# Altium schematic sheet sch.SchDoc
size A4
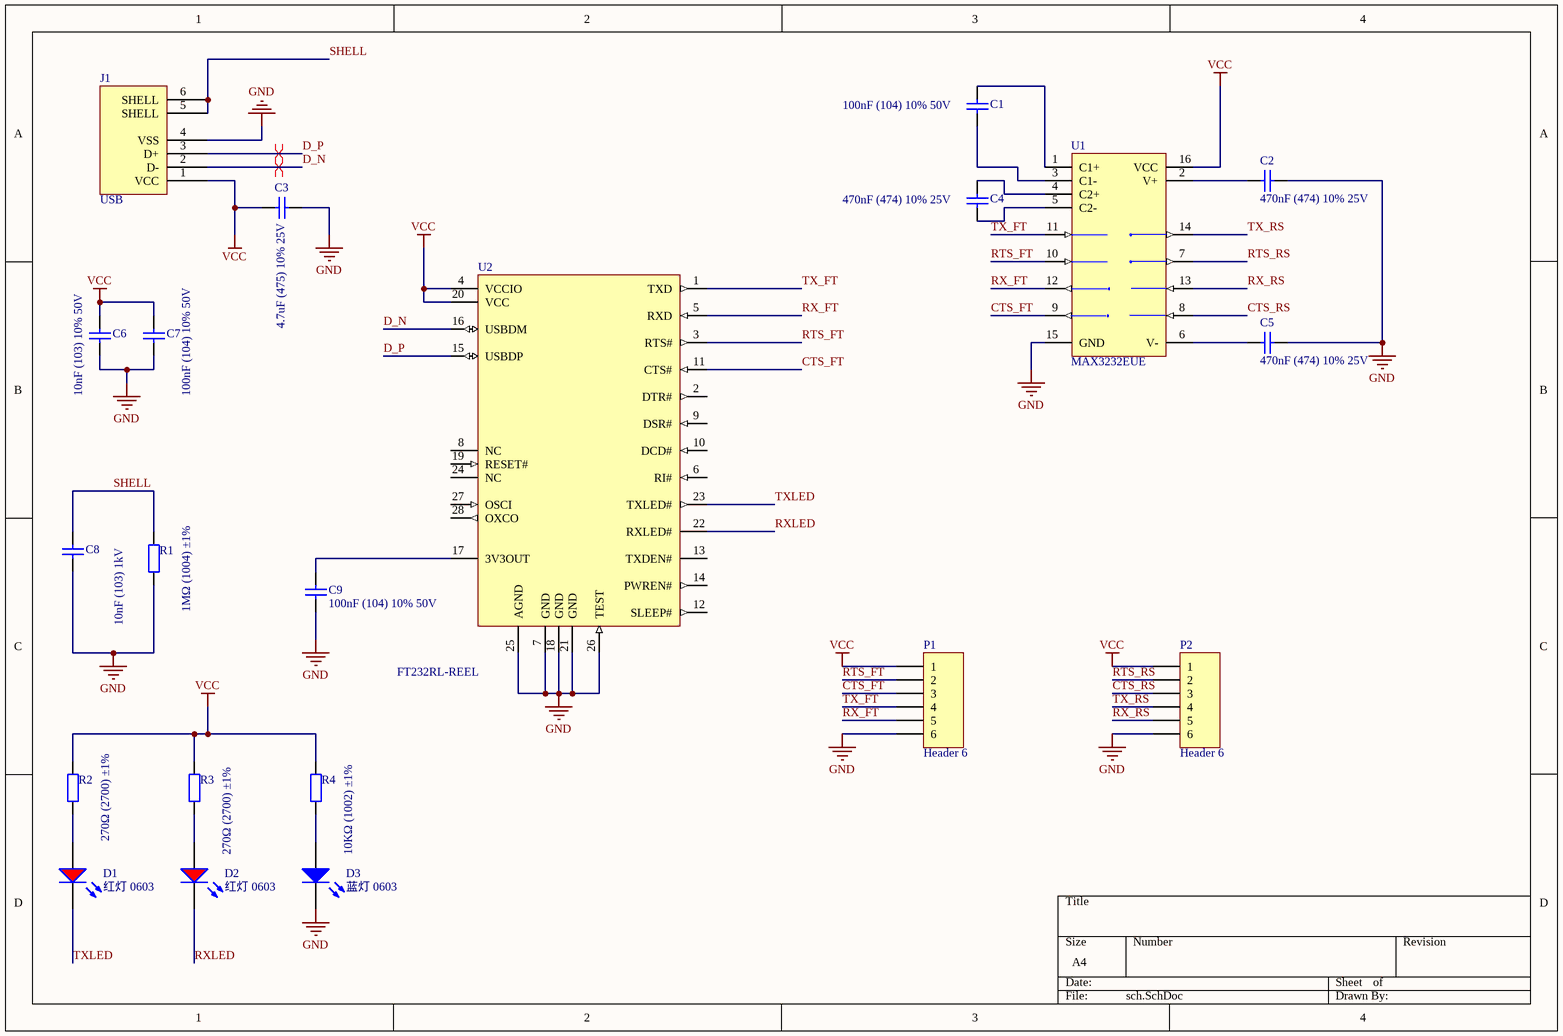
[diagram p0: sch.SchDoc]

## Parts
C1  100nF (104) 10% 50V  [0603_C]
C2  470nF (474) 10% 25V  [0603_C]
C3  4.7uF (475) 10% 25V  [0805_C]
C4  470nF (474) 10% 25V  [0603_C]
C5  470nF (474) 10% 25V  [0603_C]
C6  10nF (103) 10% 50V  [0603_C]
C7  100nF (104) 10% 50V  [0603_C]
C8  10nF (103) 1kV  [1206_C]
C9  100nF (104) 10% 50V  [0603_C]
D1  红灯 0603  [0603_LED_S1]
D2  红灯 0603  [0603_LED_S1]
D3  蓝灯 0603  [0603_LED_S1]
J1  USB  [USB_B1]
P1  Header 6  [HDR1X6]
P2  Header 6  [HDR1X6]
R1  1MΩ (1004) ±1%  [0805_R]
R2  270Ω (2700) ±1%  [0603_R]
R3  270Ω (2700) ±1%  [0603_R]
R4  10KΩ (1002) ±1%  [0603_R]
U1  MAX3232EUE  [TSSOP-16]
U2  FT232RL-REEL  [SSOP-28_208mil]

## Nets
GND: C2.2 C3.2 C5.2 C6.1 C7.1 C8.1 C9.1 D3.K J1.4(VSS) P1.6 P2.6 R1.1 U1.15(GND) U2.7(GND) U2.18(GND) U2.21(GND) U2.25(AGND) U2.26(TEST)
VCC: C3.1 C6.2 C7.2 J1.1(VCC) P1.1 P2.1 R2.2 R3.2 R4.2 U1.16(VCC) U2.4(VCCIO) U2.20(VCC)
CTS_FT: P1.3 U1.9(R2OUT) U2.11(CTS#)
CTS_RS: P2.3 U1.8(R2IN)
D_N: J1.2(D-) U2.16(USBDM)
D_P: J1.3(D+) U2.15(USBDP)
RTS_FT: P1.2 U1.10(T2IN) U2.3(RTS#)
RTS_RS: P2.2 U1.7(T2OUT)
RX_FT: P1.5 U1.12(R1OUT) U2.5(RXD)
RX_RS: P2.5 U1.13(R1IN)
RXLED: D2.K U2.22(RXLED#)
SHELL: C8.2 J1.5(SHELL) J1.6(SHELL) R1.2
TX_FT: P1.4 U1.11(T1IN) U2.1(TXD)
TX_RS: P2.4 U1.14(T1OUT)
TXLED: D1.K U2.23(TXLED#)
NetC1_1: C1.1 U1.3(C1-)
NetC1_2: C1.2 U1.1(C1+)
NetC2_1: C2.1 U1.2(V+)
NetC4_1: C4.1 U1.5(C2-)
NetC4_2: C4.2 U1.4(C2+)
NetC5_1: C5.1 U1.6(V-)
NetC9_2: C9.2 U2.17(3V3OUT)
NetD1_A: D1.A R2.1
NetD2_A: D2.A R3.1
NetD3_A: D3.A R4.1

Not connected (* = marked no-connect by the designer): U2 2(DTR#) 6(RI#) 8(NC) 9(DSR#) 10(DCD#) 12(SLEEP#) 13(TXDEN#) 14(PWREN#) 19(RESET#) 24(NC) 27(OSCI) 28(OXCO)

## Layout directives
differential pair: D_N, D_P

## Library data of the parts
C1 C7 C9 = 0603 100nF (104) 10% 50V: 贴片电容; ComponentLink1Description: 供应商链接; ComponentLink1URL: http://www.szlcsc.com/product/details_15331.html; Package: 0603; Supplier: LC; SuppliersPartNumber: C14663
C2 C4 C5 = 0603 470nF (474) 10% 25V: 贴片电容; ComponentLink1Description: 供应商链接; ComponentLink1URL: http://www.szlcsc.com/product/details_1975.html; Package: 0603; Supplier: LC; SuppliersPartNumber: C1623
C3 = 0805 4.7uF (475) 10% 25V: 贴片电容; ComponentLink1Description: 供应商链接; ComponentLink1URL: http://www.szlcsc.com/product/details_2131.html; Package: 0805; Supplier: LC; SuppliersPartNumber: C1779
C6 = 0603 10nF (103) 10% 50V: 贴片电容; ComponentLink1Description: 供应商链接; ComponentLink1URL: http://www.szlcsc.com/product/details_58143.html; Package: 0603; Supplier: LC; SuppliersPartNumber: C57112
C8 = 1206 10nF (103) 10% 50V: 贴片电容; ComponentLink1Description: 供应商链接; ComponentLink1URL: http://www.szlcsc.com/product/details_2198.html; Package: 1206; Supplier: LC; SuppliersPartNumber: C1846
D1 D2 = 0603 红灯: 发光二极管; ComponentLink1Description: 供应商链接; ComponentLink1URL: http://www.szlcsc.com/product/details_2659.html; Package: 0603; Supplier: LC; SuppliersPartNumber: C2286
D3 = 0603 蓝灯: 发光二极管; ComponentLink1Description: 供应商链接; ComponentLink1URL: http://www.szlcsc.com/product/details_73150.html; Package: 0603; Supplier: LC; SuppliersPartNumber: C72041
J1 = USB: USB接口
P1 P2 = Header 6: Header, 6-Pin; LatestRevisionDate: 17-Jul-2002; LatestRevisionNote: Re-released for DXP Platform.; Publisher: Altium Limited
R1 = 0805 1MΩ (1004) 1%: 贴片电阻; ComponentLink1Description: 供应商链接; ComponentLink1URL: http://www.szlcsc.com/product/details_18202.html; Package: 0805; Supplier: LC; SuppliersPartNumber: C17514
R2 R3 = 0603 270Ω (2700) 1%: 贴片电阻; ComponentLink1Description: 供应商链接; ComponentLink1URL: http://www.szlcsc.com/product/details_23693.html; Package: 0603; Supplier: LC; SuppliersPartNumber: C22966
R4 = 0603 10KΩ (1002) 1%: 贴片电阻; ComponentLink1Description: 供应商链接; ComponentLink1URL: http://www.szlcsc.com/product/details_26547.html; Package: 0603; Supplier: LC; SuppliersPartNumber: C25804
U1 = SP3232EEY-L/TR: RS232; ComponentLink1Description: 供应商链接; ComponentLink1URL: http://www.szlcsc.com/product/details_14131.html; Package: TSSOP-16; Supplier: LC; SuppliersPartNumber: C13482
U2 = FT232RL-REEL: USB; ComponentLink1Description: 供应商链接; ComponentLink1URL: http://www.szlcsc.com/product/details_9194.html; Package: SSOP-28_208mil; Supplier: LC; SuppliersPartNumber: C8690